# Altium schematic sheet Sheet1.SchDoc
size 431 x 279 mm; DocumentNumber: 1; SheetNumber: 1; SheetTotal: 1; ENG_APP_DATE: --/--/--; DSN_APP_DATE: --/--/--; CHK_APP_DATE: --/--/--
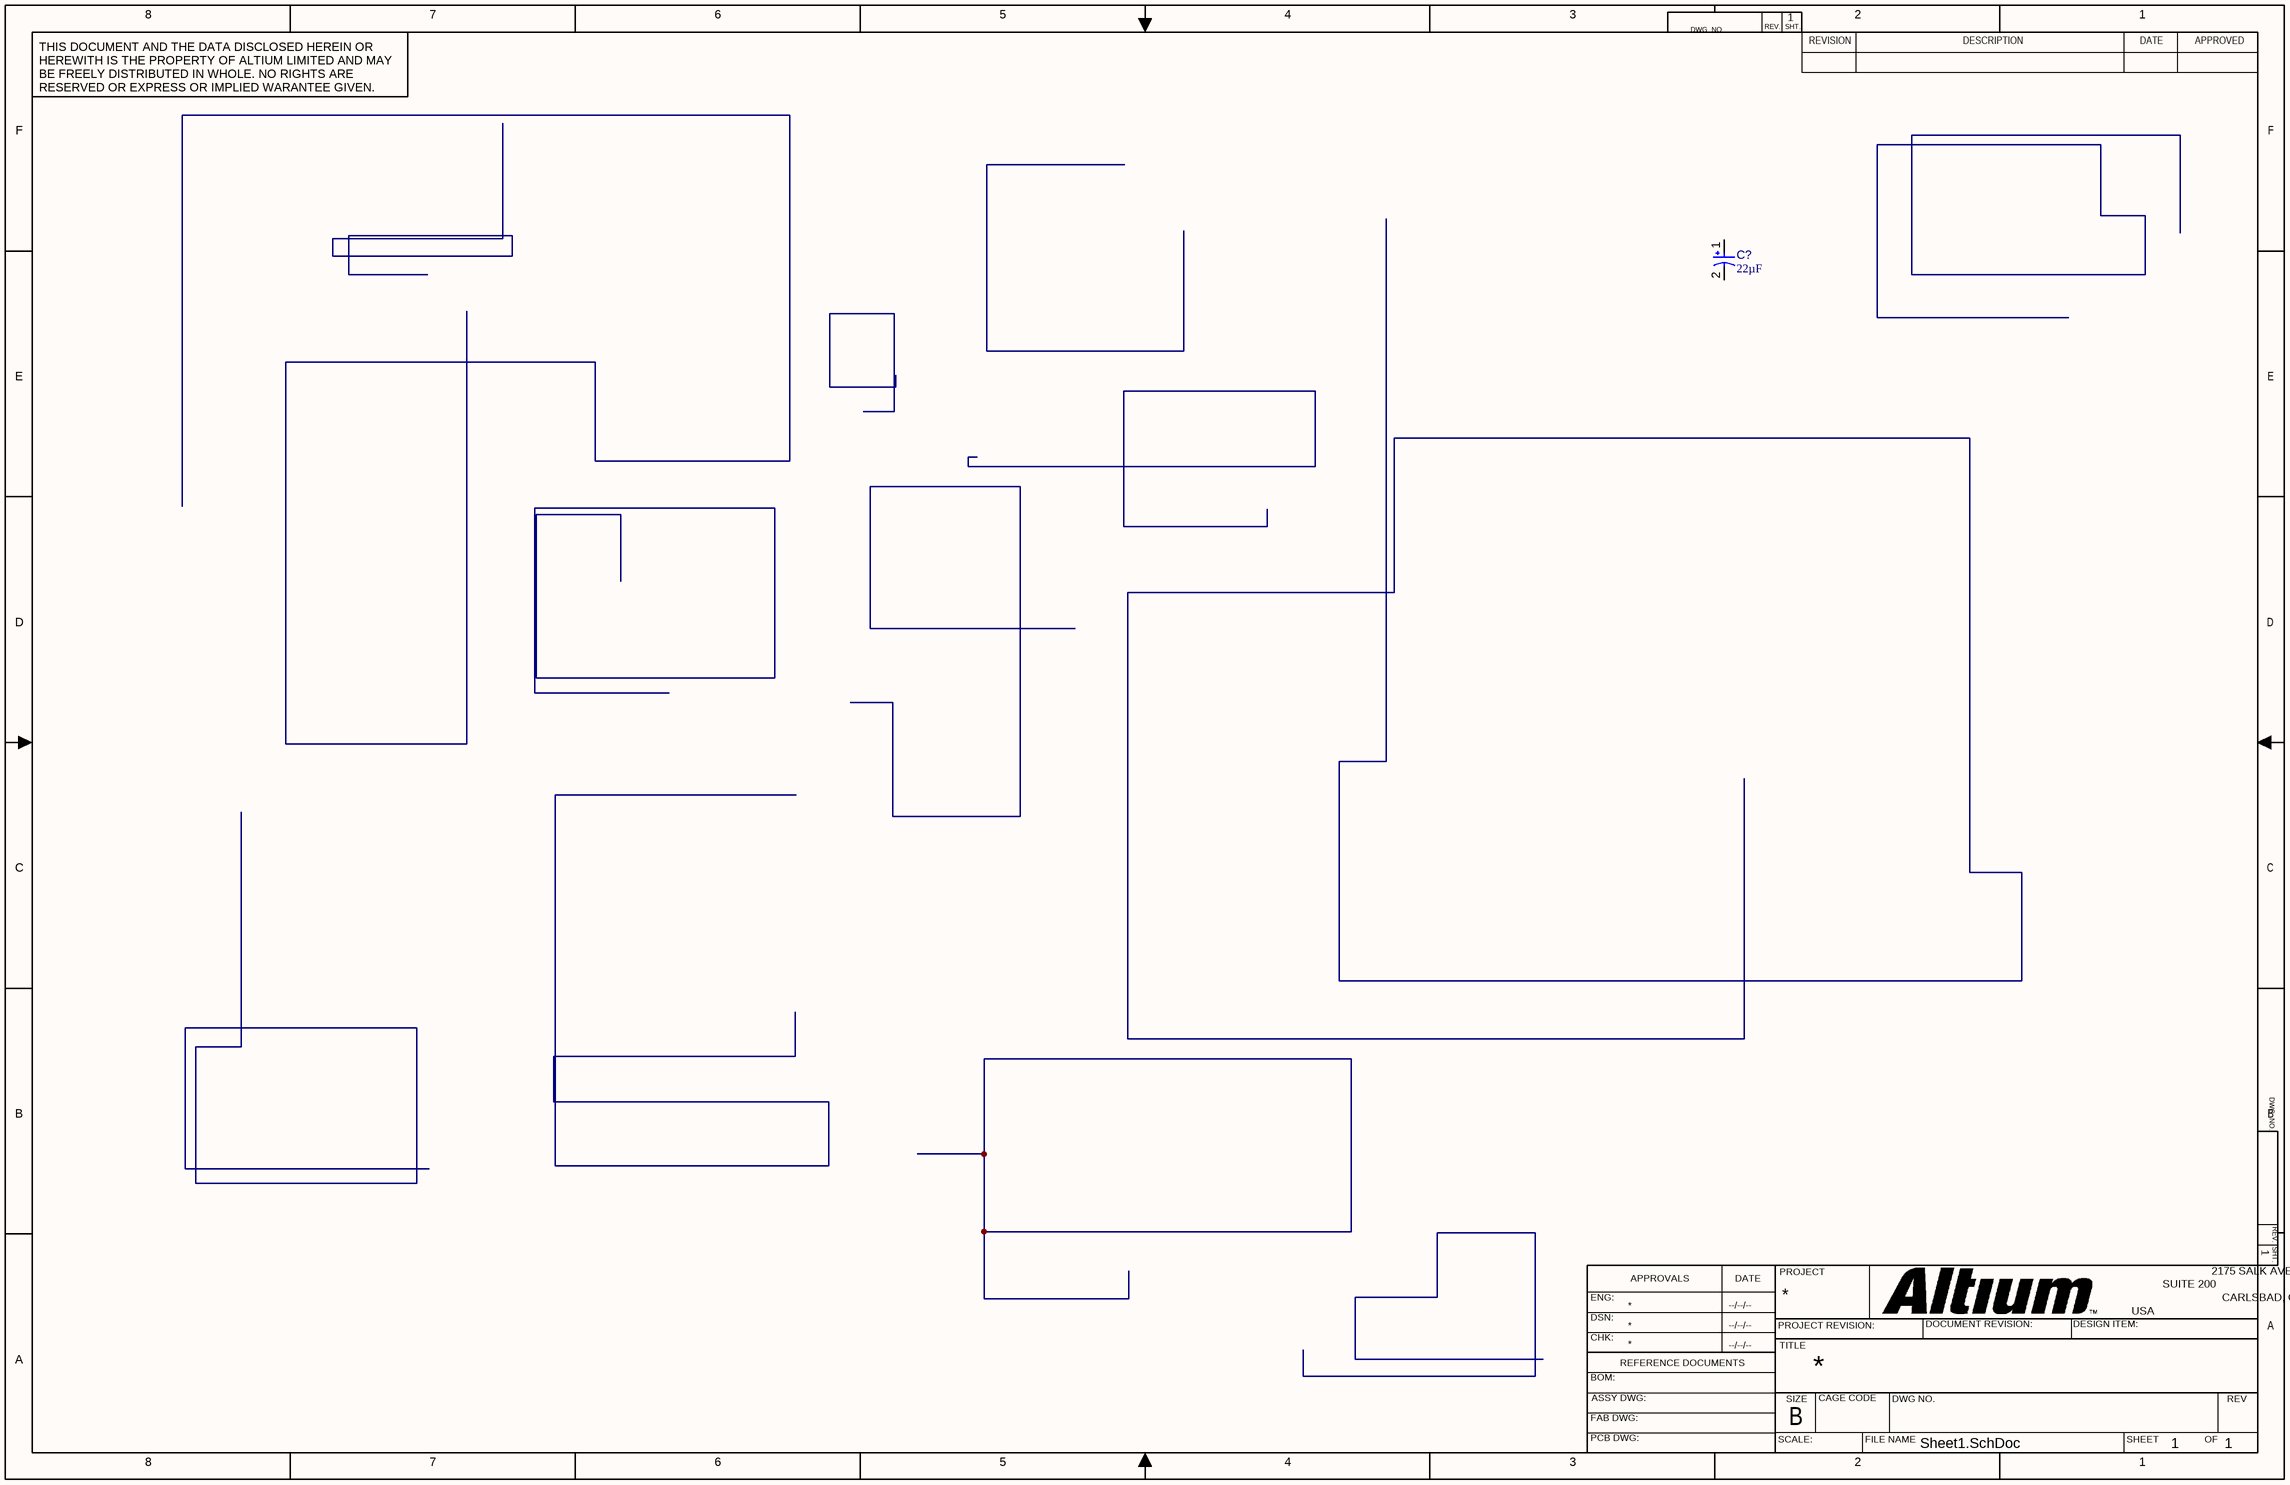
[diagram p0: Sheet1.SchDoc]

## Parts
C?  value 22µF  [AVX-TAJ-B-2_M]  (hidden comment: TAJB226K016RNJ)

## Nets

Not connected (* = marked no-connect by the designer): C? 1 2

## Notes on the sheet
- 8
- 7
- 6
- 5
- 4
- 3
- DWG. NO.
- REV.
- SHT.
- 2
- 1
- THIS DOCUMENT AND THE DATA DISCLOSED HEREIN OR HEREWITH IS THE PROPERTY OF ALTIUM LIMITED AND MAY BE FREELY DISTRIBUTED IN WHOLE. NO RIGHTS ARE RESERVED OR EXPRESS OR IMPLIED WARANTEE GIVEN.
- REVISION
- DESCRIPTION
- DATE
- APPROVED
- F
- E
- D
- C
- B
- ENG:
- APPROVALS
- PROJECT
- SUITE 200
- 2175 SALK AVENUE
- CARLSBAD, CA 92008
- A
- DSN:
- CHK:
- REFERENCE DOCUMENTS
- PROJECT REVISION:
- TITLE
- DOCUMENT REVISION:
- DESIGN ITEM:
- USA
- BOM:
- FAB DWG:
- PCB DWG:
- ASSY DWG:
- SCALE:
- SIZE
- CAGE CODE
- FILE NAME
- DWG NO.
- SHEET
- OF
- REV

## Library data of the parts
C? = CMP-001-00044-5: Standard Tantalum, 22 uF, +/- 10%, 16 V, -55 to 125 degC, 1210 (3528 Metric), RoHS, Tape and Reel; Manufacturer: AVX; ESR: 2.3Ohm; Voltage Rating: 16V; Packaging: TapeandReel; Manufacturer URL: http://www.avx.com/; Datasheet URL: http://datasheets.avx.com/TAJ.pdf; Package Quantity: 2000; Max Operating Temperature: 125°C; Case/Package: 1210; RoHS Compliant: True; Tolerance: 10%; Package Description: 2-Pin Surface Mount Device, Body 3.5 x 2.85 mm; Capacitor Type: Tantalum; Pins: 2; Min Operating Temperature: -55°C; Package Reference: TAJ-B-2; Datasheet Version: Feb-16; Mounting Technology: SM